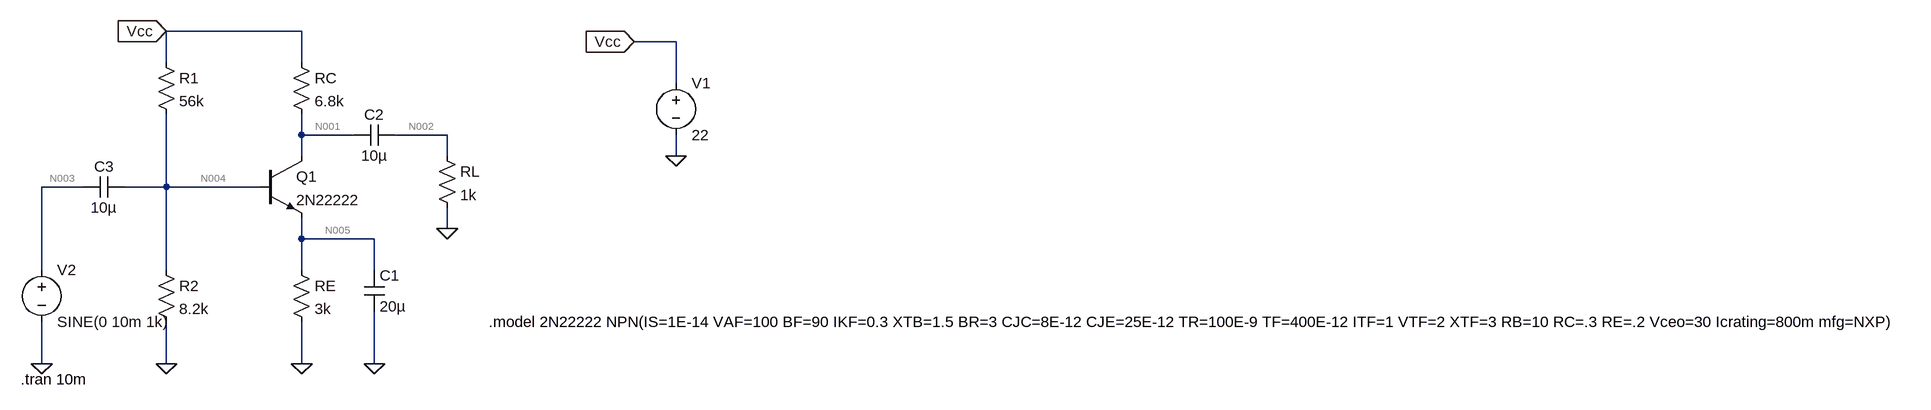
[diagram p0: schematic Draft2.asc]
Draft2.asc, the LTspice schematic file:
Version 4.1
SHEET 1 2812 680
WIRE 224 -80 16 -80
WIRE 800 -64 736 -64
WIRE 16 -32 16 -80
WIRE 224 -32 224 -80
WIRE 800 0 800 -64
WIRE 224 80 224 48
WIRE 304 80 224 80
WIRE 448 80 368 80
WIRE 224 112 224 80
WIRE 448 112 448 80
WIRE 800 112 800 80
WIRE -112 160 -176 160
WIRE 16 160 16 48
WIRE 16 160 -48 160
WIRE 160 160 16 160
WIRE 448 224 448 192
WIRE 224 240 224 208
WIRE 336 240 224 240
WIRE -176 288 -176 160
WIRE 16 288 16 160
WIRE 224 288 224 240
WIRE 336 288 336 240
WIRE -176 432 -176 368
WIRE 16 432 16 368
WIRE 224 432 224 368
WIRE 336 432 336 352
FLAG 224 432 0
FLAG 336 432 0
FLAG 448 224 0
FLAG 16 432 0
FLAG 16 -80 Vcc
IOPIN 16 -80 In
FLAG 736 -64 Vcc
IOPIN 736 -64 In
FLAG 800 112 0
FLAG -176 432 0
SYMBOL npn 160 112 R0
SYMATTR InstName Q1
SYMATTR Value 2N22222
SYMBOL res 208 272 R0
SYMATTR InstName RE
SYMATTR Value 3k
SYMBOL cap 320 288 R0
SYMATTR InstName C1
SYMATTR Value 20µ
SYMBOL res 208 -48 R0
SYMATTR InstName RC
SYMATTR Value 6.8k
SYMBOL cap 368 64 R90
WINDOW 0 0 32 VBottom 2
WINDOW 3 32 32 VTop 2
SYMATTR InstName C2
SYMATTR Value 10µ
SYMBOL res 432 96 R0
SYMATTR InstName RL
SYMATTR Value 1k
SYMBOL res 0 -48 R0
SYMATTR InstName R1
SYMATTR Value 56k
SYMBOL res 0 272 R0
SYMATTR InstName R2
SYMATTR Value 8.2k
SYMBOL voltage 800 -16 R0
WINDOW 123 0 0 Left 0
WINDOW 39 0 0 Left 0
SYMATTR InstName V1
SYMATTR Value 22
SYMBOL cap -48 144 R90
WINDOW 0 0 32 VBottom 2
WINDOW 3 32 32 VTop 2
SYMATTR InstName C3
SYMATTR Value 10µ
SYMBOL voltage -176 272 R0
WINDOW 123 0 0 Left 0
WINDOW 39 0 0 Left 0
SYMATTR InstName V2
SYMATTR Value SINE(0 10m 1k)
TEXT 512 368 Left 2 !.model 2N22222 NPN(IS=1E-14 VAF=100 BF=90 IKF=0.3 XTB=1.5 BR=3 CJC=8E-12 CJE=25E-12 TR=100E-9 TF=400E-12 ITF=1 VTF=2 XTF=3 RB=10 RC=.3 RE=.2 Vceo=30 Icrating=800m mfg=NXP)
TEXT -208 456 Left 2 !.tran 10m

The netlist it stands for:
* Draft2.asc
Q1 N001 N004 N005 0 2N22222
RE N005 0 3k
C1 N005 0 20µ
RC Vcc N001 6.8k
C2 N002 N001 10µ
RL N002 0 1k
R1 Vcc N004 56k
R2 N004 0 8.2k
V1 Vcc 0 22
C3 N004 N003 10µ
V2 N003 0 SINE(0 10m 1k)
.model NPN NPN
.model PNP PNP
.lib standard.bjt
.model 2N22222 NPN(IS=1E-14 VAF=100 BF=90 IKF=0.3 XTB=1.5 BR=3 CJC=8E-12 CJE=25E-12 TR=100E-9 TF=400E-12 ITF=1 VTF=2 XTF=3 RB=10 RC=.3 RE=.2 Vceo=30 Icrating=800m mfg=NXP)
.tran 10m
.backanno
.end

* Results of the author's LTspice run, read from the files saved beside the schematic
* Operating Point, zero values left out:
*   V(n004) = 2.761 V
*   V(vcc) = 22 V
*   V(n001) = 17.24 V
*   V(n005) = 2.119 V
*   Ic(Q1) = 699.4 µA
*   Ib(Q1) = 6.802 µA
*   Ie(Q1) = -706.2 µA
*   I(R2) = 336.7 µA
*   I(RE) = 706.2 µA
*   I(V1) = -1.043 mA
*   I(RC) = 699.4 µA
*   I(R1) = 343.5 µA
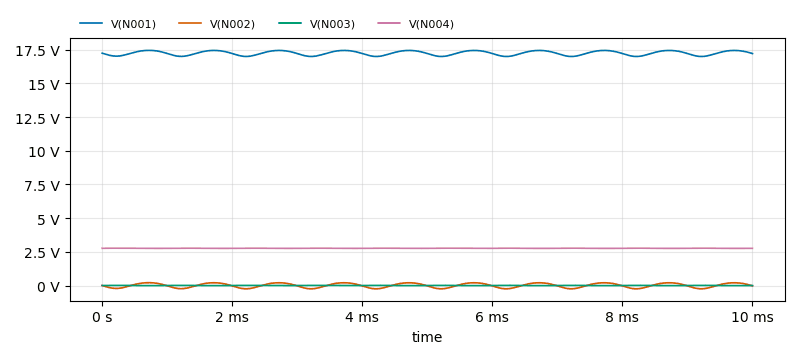
[diagram p1: Transient Analysis of Draft2.asc, plotted from the saved traces]
* Transient Analysis, 1 run:
*   V(N001): min 17 V, max 17.45 V, average 17.24 V, rms 17.25 V, last 17.22 V
*   V(N002): min -244.2 mV, max 210.6 mV, average 2.056 mV, rms 157.3 mV, last -29.67 mV
*   V(N003): min -10 mV, max 9.998 mV, average -600.8 nV, rms 7.07 mV, last 0 V
*   V(N004): min 2.751 V, max 2.771 V, average 2.761 V, rms 2.761 V, last 2.761 V